# EAGLE design micro-stepper-driver-v1 (EAGLE 8.3.1)
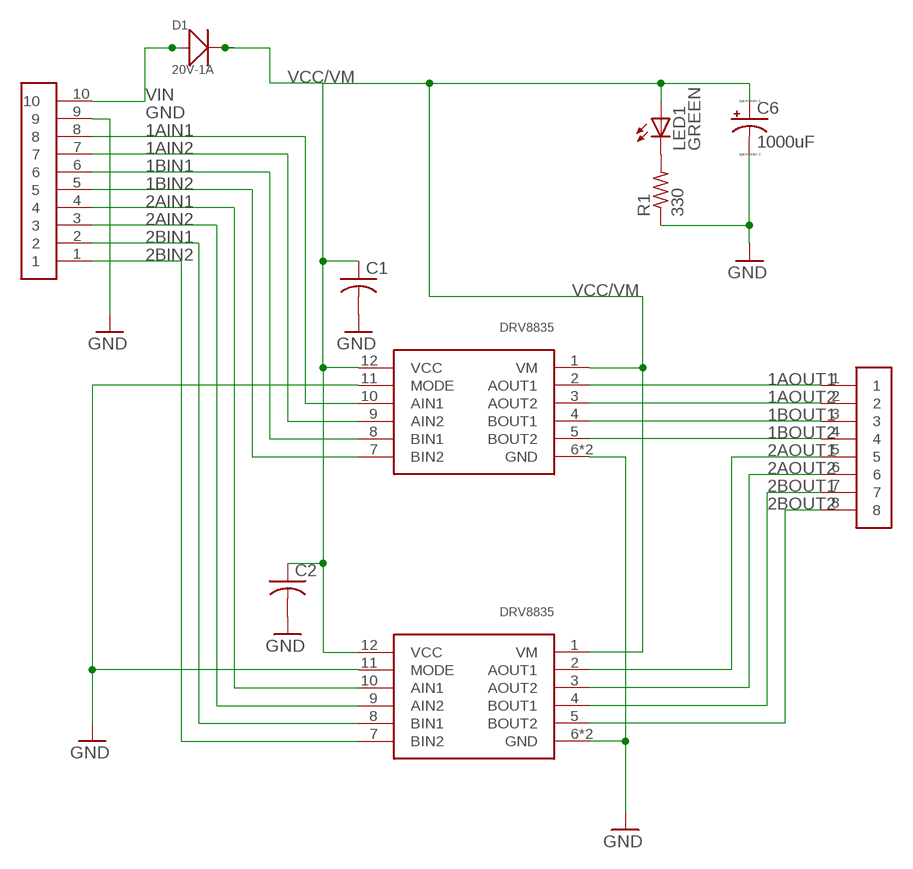
[diagram p0: schematic, sheet 1]

## Parts
C1  C-USC0402K  [C0402K]
C2  C-USC0402K  [C0402K]
C6  1000uF  CPOL-US153CLV-0810  [153CLV-0810]
D1  20V-1A  SMD-DIODE-SCHOTTKY-20V-1A(SOD-123)  [SOD-123]
LED1  GREEN  LEDSML0603  [SML0603]
R1  330  R-US_R0402  [R0402]
U$1  DRV8835  [DRV8835]
U$2  EDGE_MOUNT_HEADER_X10  [EDGE_MOUNT_HEAD_X10]
U$3  EDGE_MOUNT_HEAD_X8  [EDGE_MOUNT_HEAD_X8]
U$4  DRV8835  [DRV8835]

## Nets
1AIN1: U$2.8 U$4.10(AIN1)
1AIN2: U$2.7 U$4.9(AIN2)
1AOUT1: U$3.1 U$4.2(AOUT1)
1AOUT2: U$3.2 U$4.3(AOUT2)
1BIN1: U$2.6 U$4.8(BIN1)
1BIN2: U$2.5 U$4.7(BIN2)
1BOUT1: U$3.3 U$4.4(BOUT1)
1BOUT2: U$3.4 U$4.5(BOUT2)
2AIN1: U$1.10(AIN1) U$2.4
2AIN2: U$1.9(AIN2) U$2.3
2AOUT1: U$1.2(AOUT1) U$3.5
2AOUT2: U$1.3(AOUT2) U$3.6
2BIN1: U$1.8(BIN1) U$2.2
2BIN2: U$1.7(BIN2) U$2.1
2BOUT1: U$1.4(BOUT1) U$3.7
2BOUT2: U$1.5(BOUT2) U$3.8
GND: C1.2 C2.2 C6.- R1.1 U$1.6(GND) U$1.11(MODE) U$1.PAD(GND) U$2.9 U$4.6(GND) U$4.11(MODE) U$4.PAD(GND)
N$2: LED1.C R1.2
VCC/VM: C1.1 C2.1 C6.+ D1.- LED1.A U$1.1(VM) U$1.12(VCC) U$4.1(VM) U$4.12(VCC)
VIN: D1.+ U$2.10

## Library data of the parts
C1 C2 = resistor:C-US: CAPACITOR, American symbol
C6 = resistor:CPOL-US: POLARIZED CAPACITOR, American symbol
D1 = Seeed-Diode:SMD-DIODE-SCHOTTKY-20V-1A(SOD-123): 304020034; MPN: B5819W
LED1 = led:LED: LED OSRAM: - CHIPLED LG R971, LG N971, LY N971, LG Q971, LY Q971, LO R971, LY R971 LH N974, LH R974 LS Q976, LO Q976, LY Q976 LO Q996 - Hyper CHIPLED LW Q18S LB Q993, LB Q99A, LB R99A - SideLED LS A670, LO A670, LY A670, LG A670, LP A670 LB A673, LV A673, LT A673, LW A673 LH A674 LY A675 LS A676, LA A676, LO A676, LY A676, LW A676 LS A679, LY A679, LG A679 - Hyper Micro SIDELED® LS Y876, LA Y876, LO Y876, LY Y876 LT Y87S - SmartLED LW L88C, LW L88S LB L89C, LB L89S, LG L890 LS L89K, LO L89K, LY L89K LS L896, LA L896, LO L896, LY L896 - TOPLED LS T670, LO T670, LY T670, LG T670, LP T670 LSG T670, LSP T670, LSY T670, LOP T670, LYG T670 LG T671, LOG T671, LSG T671 LB T673, LV T673, LT T673, LW T673 LH T674 LS T676, LA T676, LO T676, LY T676, LB T676, LH T676, LSB T676, LW T676 LB T67C, LV T67C, LT T67C, LS T67K, LO T67K, LY T67K, LW E67C LS E67B, LA E67B, LO E67B, LY E67B, LB E67C, LV E67C, LT E67C LW T67C LS T679, LY T679, LG T679 LS T770, LO T770, LY T770, LG T770, LP T770 LB T773, LV T773, LT T773, LW T773 LH T774 LS E675, LA E675, LY E675, LS T675 LS T776, LA T776, LO T776, LY T776, LB T776 LHGB T686 LT T68C, LB T68C - Hyper Mini TOPLED® LB M676 - Mini TOPLED Santana® LG M470 LS M47K, LO M47K, LY M47K Source: http://www.osram.convergy.de LUXEON: - LUMILED® LXK2-PW12-R00, LXK2-PW12-S00, LXK2-PW14-U00, LXK2-PW14-V00 LXK2-PM12-R00, LXK2-PM12-S00, LXK2-PM14-U00 LXK2-PE12-Q00, LXK2-PE12-R00, LXK2-PE12-S00, LXK2-PE14-T00, LXK2-PE14-U00 LXK2-PB12-K00, LXK2-PB12-L00, LXK2-PB12-M00, LXK2-PB14-N00, LXK2-PB14-P00, LXK2-PB14-Q00 LXK2-PR12-L00, LXK2-PR12-M00, LXK2-PR14-Q00, LXK2-PR14-R00 LXK2-PD12-Q00, LXK2-PD12-R00, LXK2-PD12-S00 LXK2-PH12-R00, LXK2-PH12-S00 LXK2-PL12-P00, LXK2-PL12-Q00, LXK2-PL12-R00 Source: www.luxeon.com KINGBRIGHT: KA-3528ASYC Source: www.kingbright.com
R1 = resistor:R-US_: RESISTOR, American symbol
U$1 U$4 = Ladvien_Eagle_Parts:DRV8835
U$2 = Ladvien_Eagle_Parts:EDGE_MOUNT_HEADER_X10
U$3 = Ladvien_Eagle_Parts:EDGE_MOUNT_HEAD_X8

## Board
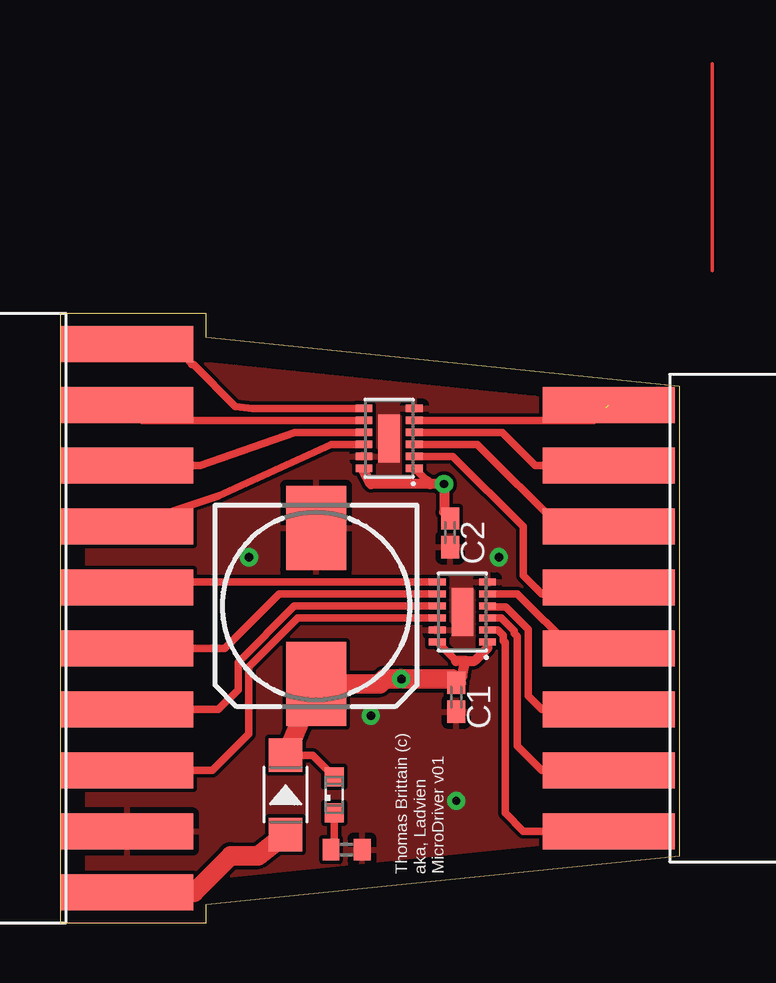
[diagram p1: board, top side]
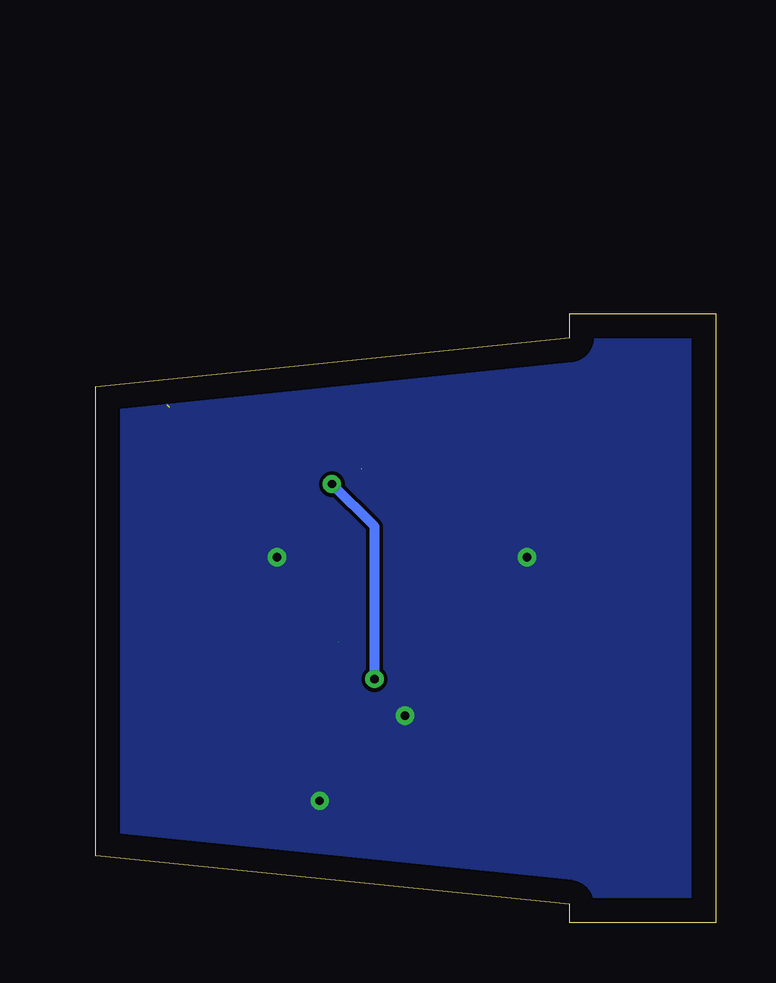
[diagram p2: board, bottom side, seen from below]

Size 25.83 x 25.4 mm. Coordinates in mm from the lower left corner, seen from the top.
Outline: 0,0 6.1,0 6.1,0.76 25.83,2.79 25.83,22.34 6.1,24.38 6.1,25.4 0,25.4 0,0
Copper layers (1*16): Top 0.035mm / dielectric 1.5mm / Bottom 0.035mm
Design rules "default *": minimum track width 6mil, minimum drill 0.35mm, track to track 6mil, track to pad 6mil, pad to pad 6mil, via to via 6mil, smd to smd 6mil, copper to edge 40mil, drill to drill 6mil, minimum pad ring 10mil, minimum via ring 8mil, stop-mask expansion 4mil, vias tented up to drill 0.35mm, thermal gap 10mil

### Footprints (pad centres in the part's own frame; a part is rotated, then mirrored left to right if it is on the bottom)
C0402K = smd 0.925 x 0.74: 1 -0.6,0; 2 0.6,0
153CLV-0810 = smd 3.5 x 2.5: + 3.25,0; - -3.25,0
SOD-123 = smd 1.397 x 1.397: + -1.651,0; - 1.651,0
SML0603 = smd 0.8 x 0.8: A 0.75,0; C -0.75,0
R0402 = smd 0.7 x 0.9: 1 -0.65,0; 2 0.65,0
DRV8835 = smd 0.7 x 0.3: 1 -3.59,1.25; 2 -3.59,0.75; 3 -3.59,0.25; 4 -3.59,-0.25; 5 -3.59,-0.75; 6 -3.59,-1.25; 7 -1.49,-1.25; 8 -1.49,-0.75; 9 -1.49,-0.25; 10 -1.49,0.25; 11 -1.49,0.75; 12 -1.49,1.25 | smd 0.9 x 2: PAD -2.54,0
EDGE_MOUNT_HEAD_X10 = smd 1.5 x 5.5: 1 1.27,3.81; 2 3.81,3.81; 3 6.35,3.81; 4 8.89,3.81; 5 11.43,3.81; 6 13.97,3.81; 7 16.51,3.81; 8 19.05,3.81; 9 21.59,3.81; 10 24.13,3.81
EDGE_MOUNT_HEAD_X8 = smd 1.5 x 5.5: 1 0,2.54; 2 2.54,2.54; 3 5.08,2.54; 4 7.62,2.54; 5 10.16,2.54; 6 12.7,2.54; 7 15.24,2.54; 8 17.78,2.54

### Placement (x,y rotation side)
C1  16.51,9.4 270 top
C2  16.26,16.26 270 top
C6  10.67,13.21 270 top
D1  9.4,5.33 90 top
LED1  11.43,5.33 90 top
R1  11.94,3.05 180 top
U$1  11.18,20.19 180 top
U$2  -1.02,25.4 270 top
U$3  25.4,3.81 90 top
U$4  14.22,12.95 180 top

### Tracks (layer width: path | path; a pad name or v marks a point on that pad's centre or on a via)
1AIN1
  Top 0.305: U$4.10 9.91,12.7 7.87,10.67 7.87,7.87 6.35,6.35 U$2.8
1AIN2
  Top 0.305: U$4.9 9.76,13.2 7.42,10.86 7.42,9.7 6.6,8.89 U$2.7
1AOUT1
  Top 0.305: U$4.2 18.25,12.2 18.47,11.98 18.47,11.76 18.54,11.68 18.54,4.57 19.3,3.81 U$3.1
1AOUT2
  Top 0.305: U$4.3 18.39,12.7 18.93,12.17 18.93,12.06 19.05,11.94 19.05,7.37 20.07,6.35 U$3.2
1BIN1
  Top 0.305: U$4.8 9.13,13.7 6.86,11.43 U$2.6
1BIN2
  Top 0.305: U$4.7 3.03,14.2 U$2.5
1BOUT1
  Top 0.305: U$4.4 17.86,13.16 18.58,13.16 19.51,12.23 19.51,9.45 20.07,8.89 U$3.3
1BOUT2
  Top 0.305: U$4.5 19.06,13.7 21.34,11.43 U$3.4
2AIN1
  Top 0.305: U$1.10 11.31,19.94 6.6,17.78 U$2.4
2AIN2
  Top 0.305: U$1.9 9.78,20.44 5.84,19.05 U$2.3
2AOUT1
  Top 0.305: U$1.2 16.37,19.44 19.3,16.51 19.3,14.48 20.07,13.72 22.61,13.72 U$3.5
2AOUT2
  Top 0.305: U$1.3 17.39,19.94 20.83,16.51 U$3.6
2BIN1
  Top 0.305: U$1.8 3.44,20.94 U$2.2
2BIN2
  Top 0.305: U$1.7 8.02,21.44 7.31,21.52 5.56,23.26 5.49,23.27 5.23,23.6 4.93,23.9 4.93,23.97 4.88,24.02 4.9,24.18 2.84,24.18 U$2.1
2BOUT1
  Top 0.305: U$1.4 18.42,20.44 19.81,19.05 U$3.7
2BOUT2  (1 unrouted)
  Top 0.305: U$1.5 22.21,20.94 22.76,21.49
GND  (via drill 0.35)
  other vias: 7.87,15.24 12.95,8.64 16.51,5.08 18.29,15.24
  pour Top: -0.51,-0.51 -0.51,26.16 26.42,26.16 26.42,-0.76 -0.51,-0.76
  pour Bottom: -0.51,-0.51 -0.51,26.16 26.42,26.16 26.42,-0.76 -0.51,-0.76
N$1
  Top 0.152: 27.18,27.18 27.18,35.81
N$2
  Top 0.305: LED1.C 11.43,3.19 R1.2
VCC/VM  (via drill 0.35)  (2 unrouted)
  Top 0.305: D1.- 10.53,6.99 LED1.A
  Top 0.306: U$1.12 12.67,18.83 | 16.51,10.91 U$4.12 | U$4.1 17.81,11.46 | 15.42,18.29 U$1.1
  Top 0.406: 15.42,18.29 v16,18.29 16,17.11 C2.1 | 15.28,18.43 15.42,18.29 | 12.67,18.83 12.95,18.29 15.42,18.29 | 17.81,11.46 17.27,10.92 16.89,10.92 | 16.89,10.92 16.52,10.92 16.51,10.91 | C1.1 16.76,10.29 16.89,10.92
  Top 0.813: D1.- C6.+ 13.31,9.96 13.52,10.16 v14.22,10.16 16.35,10.16 C1.1
  Bottom 0.406: v14.22,10.16 14.22,16.51 v16,18.29
VIN
  Top 0.813: U$2.10 5.59,1.27 7.11,2.79 8.25,2.79 D1.+

### Text on the board
tPlace: Thomas Brittain (c) / aka, Ladvien / MicroDriver v01